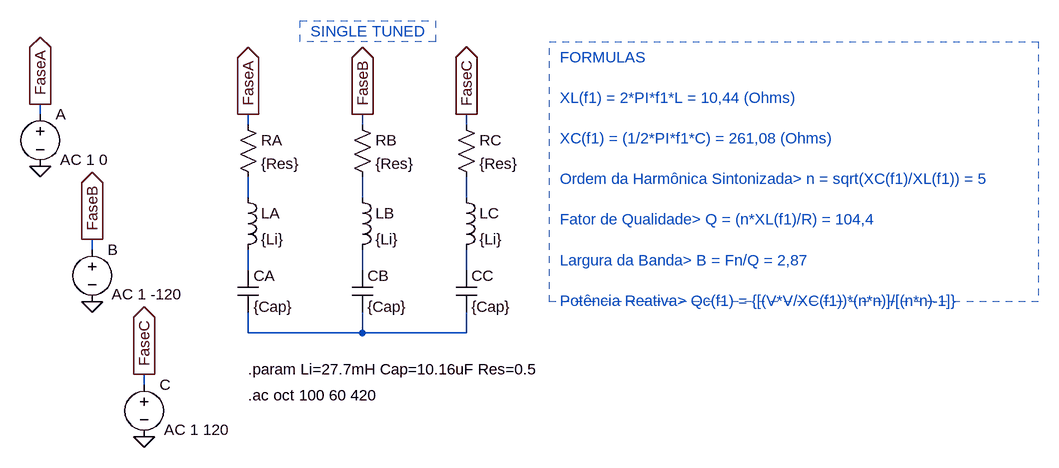
[diagram p0: schematic HarmonicFilterSigleTuned.asc]
HarmonicFilterSigleTuned.asc, the LTspice schematic file:
Version 4
SHEET 1 1632 680
WIRE -176 -16 -176 -32
WIRE 144 0 144 -16
WIRE 320 0 320 -16
WIRE 480 0 480 -16
WIRE 144 112 144 80
WIRE 320 112 320 80
WIRE 480 112 480 80
WIRE -96 192 -96 176
WIRE 144 224 144 192
WIRE 320 224 320 192
WIRE 480 224 480 192
WIRE 144 320 144 288
WIRE 320 320 320 288
WIRE 320 320 144 320
WIRE 480 320 480 288
WIRE 480 320 320 320
WIRE -16 400 -16 384
FLAG -176 64 0
FLAG -96 272 0
FLAG -16 480 0
FLAG -176 -32 FaseA
IOPIN -176 -32 Out
FLAG 144 -16 FaseA
IOPIN 144 -16 Out
FLAG 320 -16 FaseB
IOPIN 320 -16 Out
FLAG 480 -16 FaseC
IOPIN 480 -16 Out
FLAG -96 176 FaseB
IOPIN -96 176 Out
FLAG -16 384 FaseC
IOPIN -16 384 Out
SYMBOL voltage -176 -32 R0
WINDOW 3 31 86 Left 2
WINDOW 123 31 86 Left 2
WINDOW 39 0 0 Left 0
SYMATTR Value ""
SYMATTR Value2 AC 1 0
SYMATTR InstName A
SYMBOL res 128 -16 R0
SYMATTR InstName RA
SYMATTR Value {Res}
SYMBOL ind 128 96 R0
SYMATTR InstName LA
SYMATTR Value {Li}
SYMBOL cap 128 224 R0
SYMATTR InstName CA
SYMATTR Value {Cap}
SYMBOL res 304 -16 R0
SYMATTR InstName RB
SYMATTR Value {Res}
SYMBOL ind 304 96 R0
SYMATTR InstName LB
SYMATTR Value {Li}
SYMBOL cap 304 224 R0
SYMATTR InstName CB
SYMATTR Value {Cap}
SYMBOL res 464 -16 R0
SYMATTR InstName RC
SYMATTR Value {Res}
SYMBOL ind 464 96 R0
SYMATTR InstName LC
SYMATTR Value {Li}
SYMBOL cap 464 224 R0
SYMATTR InstName CC
SYMATTR Value {Cap}
SYMBOL voltage -96 176 R0
WINDOW 123 30 85 Left 2
WINDOW 39 0 0 Left 0
WINDOW 3 29 90 Left 2
SYMATTR Value2 AC 1 -120
SYMATTR Value ""
SYMATTR InstName B
SYMBOL voltage -16 384 R0
WINDOW 123 31 85 Left 2
WINDOW 39 0 0 Left 0
WINDOW 3 27 84 Left 2
SYMATTR Value2 AC 1 120
SYMATTR Value ""
SYMATTR InstName C
TEXT 144 376 Left 2 !.param Li=27.7mH Cap=10.16uF Res=0.5
TEXT 144 416 Left 2 !.ac oct 100 60 420
TEXT 624 -104 Left 2 ;FORMULAS\n \nXL(f1) = 2*PI*f1*L = 10,44 (Ohms)\n \nXC(f1) = (1/2*PI*f1*C) = 261,08 (Ohms)\n \nOrdem da Harmônica Sintonizada> n = sqrt(XC(f1)/XL(f1)) = 5\n \nFator de Qualidade> Q = (n*XL(f1)/R) = 104,4\n \nLargura da Banda> B = Fn/Q = 2,87\n \nPotência Reativa> Qc(f1) = {[(V*V/XC(f1))*(n*n)]/[(n*n)-1]}
TEXT 240 -144 Left 2 ;SINGLE TUNED
RECTANGLE Normal 1360 272 608 -128 2
RECTANGLE Normal 432 -128 224 -160 2

The netlist it stands for:
* HarmonicFilterSigleTuned.asc
V§A FaseA 0 AC 1 0
RA FaseA N001 {Res}
LA N001 N004 {Li}
CA N004 N007 {Cap}
RB FaseB N002 {Res}
LB N002 N005 {Li}
CB N005 N007 {Cap}
RC FaseC N003 {Res}
LC N003 N006 {Li}
CC N006 N007 {Cap}
V§B FaseB 0 AC 1 -120
V§C FaseC 0 AC 1 120
.param Li=27.7mH Cap=10.16uF Res=0.5
.ac oct 100 60 420
* FORMULAS
* XL(f1) = 2*PI*f1*L = 10,44 (Ohms)
* XC(f1) = (1/2*PI*f1*C) = 261,08 (Ohms)
* Ordem da Harmônica Sintonizada> n = sqrt(XC(f1)/XL(f1)) = 5
* Fator de Qualidade> Q = (n*XL(f1)/R) = 104,4
* Largura da Banda> B = Fn/Q = 2,87
* Potência Reativa> Qc(f1) = {[(V*V/XC(f1))*(n*n)]/[(n*n)-1]}
* SINGLE TUNED
.backanno
.end